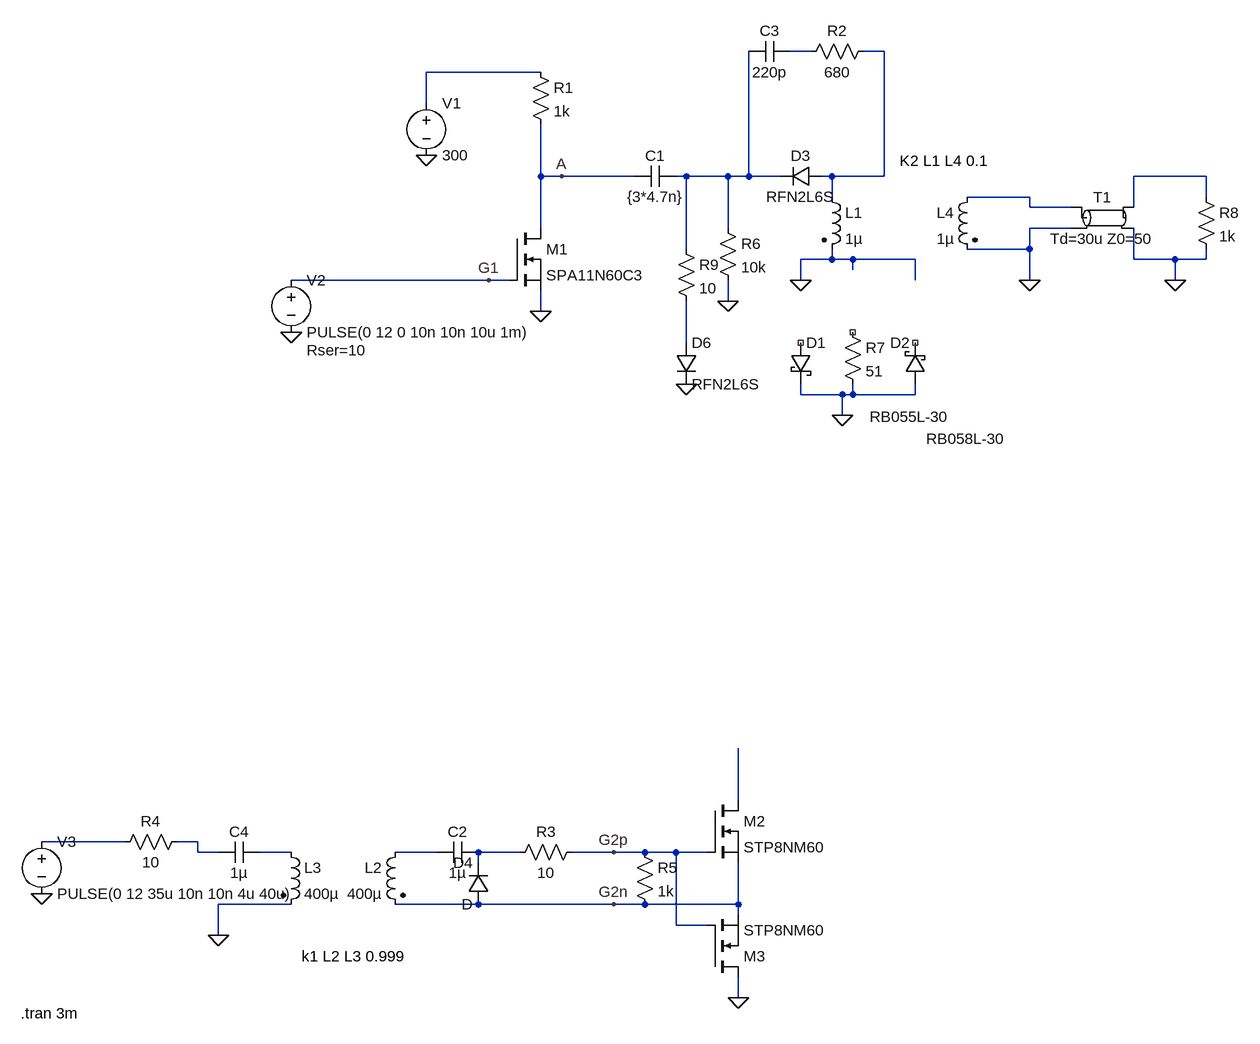
[diagram p0: schematic shev_pulse.asc]
shev_pulse.asc, the LTspice schematic file:
Version 4
SHEET 1 1048 1208
WIRE 384 -288 352 -288
WIRE 496 -288 464 -288
WIRE -32 -256 -208 -256
WIRE -208 -208 -208 -256
WIRE -32 -96 -32 -176
WIRE 0 -96 -32 -96
WIRE 112 -96 0 -96
WIRE 192 -96 176 -96
WIRE 256 -96 192 -96
WIRE 288 -96 288 -288
WIRE 288 -96 256 -96
WIRE 336 -96 288 -96
WIRE 416 -96 400 -96
WIRE 496 -96 496 -288
WIRE 496 -96 416 -96
WIRE 992 -96 880 -96
WIRE 416 -64 416 -96
WIRE 720 -64 624 -64
WIRE 992 -64 992 -96
WIRE 720 -48 720 -64
WIRE 784 -48 720 -48
WIRE 880 -48 880 -96
WIRE -32 -16 -32 -96
WIRE 256 -16 256 -96
WIRE 784 -16 720 -16
WIRE 192 16 192 -96
WIRE 720 16 720 -16
WIRE 720 16 624 16
WIRE 416 32 416 16
WIRE 416 32 368 32
WIRE 448 32 416 32
WIRE 544 32 448 32
WIRE 880 32 880 -16
WIRE 944 32 880 32
WIRE 992 32 992 16
WIRE 992 32 944 32
WIRE 448 48 448 32
WIRE -112 64 -416 64
WIRE -80 64 -112 64
WIRE 368 64 368 32
WIRE 544 64 544 32
WIRE 720 64 720 16
WIRE 944 64 944 32
WIRE 256 96 256 64
WIRE -32 112 -32 80
WIRE 192 160 192 96
WIRE 368 240 368 224
WIRE 432 240 368 240
WIRE 448 240 448 224
WIRE 448 240 432 240
WIRE 544 240 544 224
WIRE 544 240 448 240
WIRE 432 272 432 240
WIRE 272 864 272 784
WIRE -672 928 -800 928
WIRE -560 928 -592 928
WIRE -560 944 -560 928
WIRE -528 944 -560 944
WIRE -416 944 -464 944
WIRE -192 944 -256 944
WIRE -64 944 -128 944
WIRE 80 944 16 944
WIRE 128 944 80 944
WIRE 176 944 128 944
WIRE 224 944 176 944
WIRE -128 960 -128 944
WIRE -416 1024 -528 1024
WIRE -128 1024 -256 1024
WIRE 80 1024 -128 1024
WIRE 128 1024 80 1024
WIRE 272 1024 272 960
WIRE 272 1024 128 1024
WIRE 272 1040 272 1024
WIRE 176 1056 176 944
WIRE 224 1056 176 1056
WIRE -528 1072 -528 1024
WIRE 272 1168 272 1136
FLAG -208 -128 0
FLAG 432 272 0
FLAG -32 112 0
FLAG -416 144 0
FLAG 272 1168 0
FLAG -112 64 G1
FLAG 80 944 G2p
FLAG 80 1024 G2n
FLAG -800 1008 0
FLAG -528 1072 0
FLAG 256 96 0
FLAG 0 -96 A
FLAG 720 64 0
FLAG 944 64 0
FLAG 368 64 0
FLAG 192 224 0
SYMBOL voltage -208 -224 R0
WINDOW 123 0 0 Left 2
WINDOW 39 0 0 Left 2
SYMATTR InstName V1
SYMATTR Value 300
SYMBOL res -48 -272 R0
SYMATTR InstName R1
SYMATTR Value 1k
SYMBOL cap 176 -112 R90
WINDOW 0 0 32 VBottom 2
WINDOW 3 32 32 VTop 2
SYMATTR InstName C1
SYMATTR Value {3*4.7n}
SYMBOL ind2 400 -80 R0
SYMATTR InstName L1
SYMATTR Value 1µ
SYMATTR Type ind
SYMBOL schottky 352 160 R0
WINDOW 3 122 114 Left 2
SYMATTR Value RB055L-30
SYMATTR InstName D1
SYMATTR Description Diode
SYMATTR Type diode
SYMBOL schottky 560 224 R180
WINDOW 0 24 64 Left 2
WINDOW 3 -123 -84 Left 2
SYMATTR InstName D2
SYMATTR Value RB058L-30
SYMATTR Description Diode
SYMATTR Type diode
SYMBOL nmos -80 -16 R0
SYMATTR InstName M1
SYMATTR Value SPA11N60C3
SYMBOL voltage -416 48 R0
WINDOW 123 0 0 Left 2
WINDOW 39 24 124 Left 2
SYMATTR SpiceLine Rser=10
SYMATTR InstName V2
SYMATTR Value PULSE(0 12 0 10n 10n 10u 1m)
SYMBOL nmos 224 864 R0
SYMATTR InstName M2
SYMATTR Value STP8NM60
SYMBOL nmos 224 1136 M180
SYMATTR InstName M3
SYMATTR Value STP8NM60
SYMBOL diode 400 -112 R90
WINDOW 0 0 32 VBottom 2
WINDOW 3 32 32 VTop 2
SYMATTR InstName D3
SYMATTR Value RFN2L6S
SYMBOL cap 352 -304 R90
WINDOW 0 0 32 VBottom 2
WINDOW 3 32 32 VTop 2
SYMATTR InstName C3
SYMATTR Value 220p
SYMBOL res 480 -304 R90
WINDOW 0 0 56 VBottom 2
WINDOW 3 32 56 VTop 2
SYMATTR InstName R2
SYMATTR Value 680
SYMBOL ind2 -240 928 M0
SYMATTR InstName L2
SYMATTR Value 400µ
SYMATTR Type ind
SYMBOL ind2 -432 928 R0
SYMATTR InstName L3
SYMATTR Value 400µ
SYMATTR Type ind
SYMBOL cap -128 928 R90
WINDOW 0 0 32 VBottom 2
WINDOW 3 32 32 VTop 2
SYMATTR InstName C2
SYMATTR Value 1µ
SYMBOL cap -464 928 R90
WINDOW 0 0 32 VBottom 2
WINDOW 3 32 32 VTop 2
SYMATTR InstName C4
SYMATTR Value 1µ
SYMBOL res 32 928 R90
WINDOW 0 0 56 VBottom 2
WINDOW 3 32 56 VTop 2
SYMATTR InstName R3
SYMATTR Value 10
SYMBOL diode -112 1024 R180
WINDOW 0 24 64 Left 2
WINDOW 3 24 0 Left 2
SYMATTR InstName D4
SYMBOL voltage -800 912 R0
WINDOW 123 0 0 Left 2
WINDOW 39 0 0 Left 2
SYMATTR InstName V3
SYMATTR Value PULSE(0 12 35u 10n 10n 4u 40u)
SYMBOL res -576 912 R90
WINDOW 0 0 56 VBottom 2
WINDOW 3 32 56 VTop 2
SYMATTR InstName R4
SYMATTR Value 10
SYMBOL res 112 928 R0
SYMATTR InstName R5
SYMATTR Value 1k
SYMBOL res 240 -32 R0
SYMATTR InstName R6
SYMATTR Value 10k
SYMBOL res 432 128 R0
SYMATTR InstName R7
SYMATTR Value 51
SYMBOL ind2 640 -80 M0
SYMATTR InstName L4
SYMATTR Value 1µ
SYMATTR Type ind
SYMBOL tline 832 -32 R0
SYMATTR InstName T1
SYMATTR Value Td=30u Z0=50
SYMBOL res 976 -80 R0
SYMATTR InstName R8
SYMATTR Value 1k
SYMBOL diode 176 160 R0
SYMATTR InstName D6
SYMATTR Value RFN2L6S
SYMBOL res 176 0 R0
SYMATTR InstName R9
SYMATTR Value 10
TEXT -400 1104 Left 2 !k1 L2 L3 0.999
TEXT 520 -120 Left 2 !K2 L1 L4 0.1
TEXT -832 1192 Left 2 !.tran 3m

The netlist it stands for:
* shev_pulse.asc
V1 N003 0 300
R1 N003 A 1k
C1 N004 A {3*4.7n}
L1 N002 0 1µ
D1 NC_01 0 RB055L-30
D2 0 NC_02 RB058L-30
M1 A G1 0 0 SPA11N60C3
V2 G1 0 PULSE(0 12 0 10n 10n 10u 1m) Rser=10
M2 N008 G2p G2n G2n STP8NM60
M3 0 G2p G2n G2n STP8NM60
D3 N002 N004 RFN2L6S
C3 N001 N004 220p
R2 N002 N001 680
L2 N012 G2n 400µ
L3 N011 0 400µ
C2 N013 N012 1µ
C4 N011 N010 1µ
R3 G2p N013 10
D4 G2n N013 D
V3 N009 0 PULSE(0 12 35u 10n 10n 4u 40u)
R4 N010 N009 10
R5 G2p G2n 1k
R6 N004 0 10k
R7 NC_03 0 51
L4 N006 0 1µ
T1 N006 0 N005 0 Td=30u Z0=50
R8 N005 0 1k
D6 N007 0 RFN2L6S
R9 N004 N007 10
.model D D
.lib standard.dio
.model NMOS NMOS
.model PMOS PMOS
.lib standard.mos
k1 L2 L3 0.999
K2 L1 L4 0.1
.tran 3m
.backanno
.end